# EAGLE schematic Main (EAGLE 7.4.0)
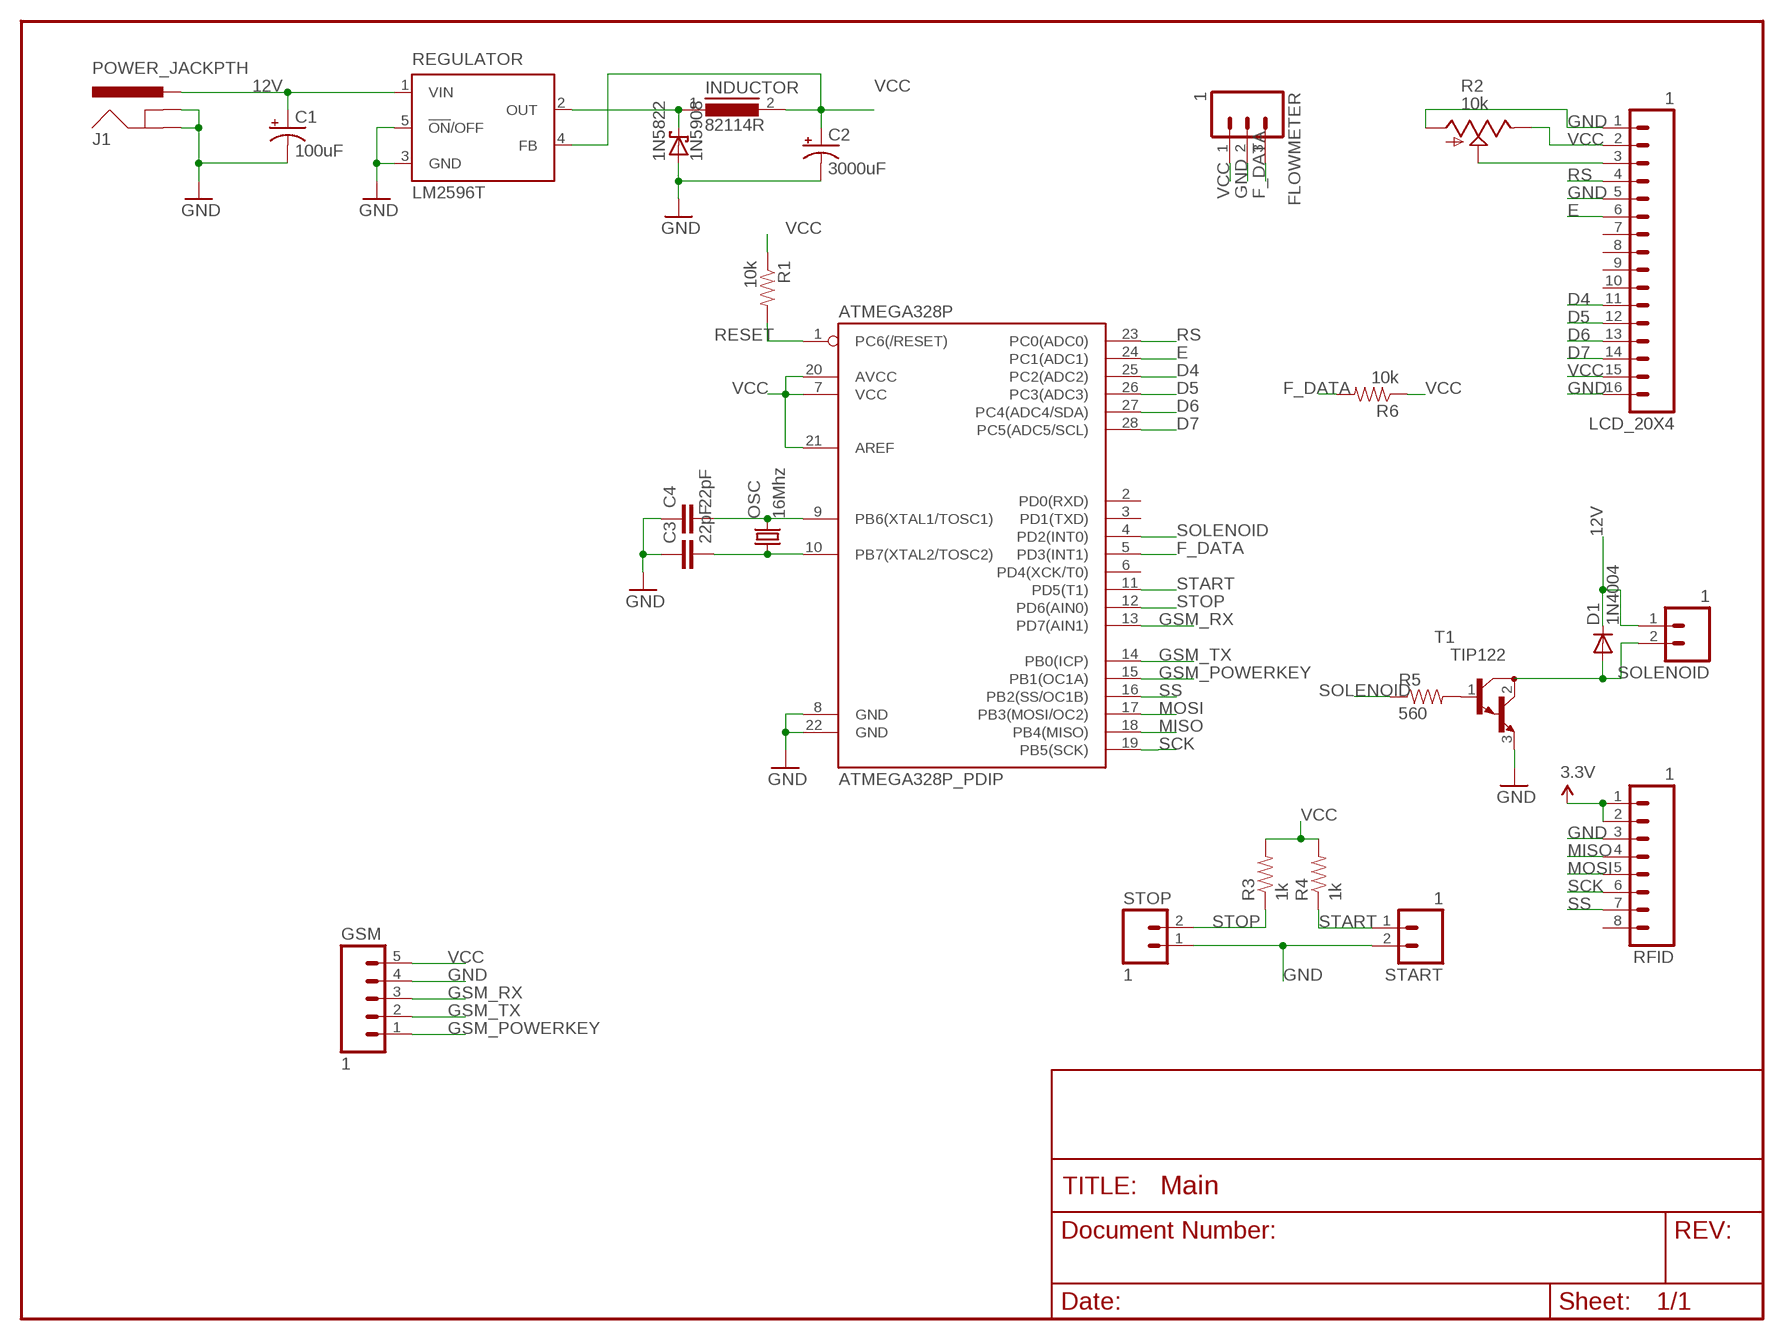
[diagram p0: schematic, sheet 1]

## Parts
1N5822  1N5908  [C4111-15]
ATMEGA328P  ATMEGA328P_PDIP  [DIL28-3]
C1  100uF  CAP_POLPTH2  [CPOL-RADIAL-10UF-25V]
C2  3000uF  CAP_POLPTH4  [CPOL-RADIAL-1000UF-25V]
C3  22pF  CAPPTH  [CAP-PTH-SMALL]
C4  22pF  CAPPTH  [CAP-PTH-SMALL]
D1  1N4004  [DO41-10]
FLOWMETER  1  M03PTH  [1X03]
GSM  1  M05PTH_LONGPADS  [1X05_LONGPADS]
INDUCTOR  82114R  [82114R]
J1  POWER_JACKPTH  [POWER_JACK_PTH]
LCD_20X4  1  M16PTH  [1X16]
OSC  16Mhz  CRYSTALHC49US  [HC49US]
R1  10k  RESISTORPTH-1/4W  [AXIAL-0.4]
R2  10k  TRIM_US-CA6V  [CA6V]
R3  1k  RESISTORPTH-1/4W  [AXIAL-0.4]
R4  1k  RESISTORPTH-1/4W  [AXIAL-0.4]
R5  560  RESISTORPTH-1/2W  [AXIAL-0.5]
R6  10k  RESISTORPTH-1/4W  [AXIAL-0.4]
REGULATOR  LM2596T  [T05D]
RFID  1  M08  [1X08_ROUND]
SOLENOID  1  M02PTH  [1X02]
START  1  M02PTH  [1X02]
STOP  1  M02PTH  [1X02]
T1  TIP122  [TO220]

## Nets
3.3V: RFID.1 RFID.2
12V: C1.1(+) D1.C J1.PWR REGULATOR.1(VIN) SOLENOID.1
D4: ATMEGA328P.25(PC2(ADC2)) LCD_20X4.11
D5: ATMEGA328P.26(PC3(ADC3)) LCD_20X4.12
D6: ATMEGA328P.27(PC4(ADC4/SDA)) LCD_20X4.13
D7: ATMEGA328P.28(PC5(ADC5/SCL)) LCD_20X4.14
E: ATMEGA328P.24(PC1(ADC1)) LCD_20X4.6
F_DATA: ATMEGA328P.5(PD3(INT1)) FLOWMETER.3 R6.P$2
GND: 1N5822.A ATMEGA328P.8(GND) ATMEGA328P.22(GND) C1.2(-) C2.2(-) C3.1 C4.1 FLOWMETER.2 GSM.4 J1.GND J1.GNDBREAK LCD_20X4.1 LCD_20X4.5 LCD_20X4.16 R2.A REGULATOR.3(GND) REGULATOR.5(!ON!/OFF) RFID.3 START.2 STOP.1 T1.3(E)
GSM_POWERKEY: ATMEGA328P.15(PB1(OC1A)) GSM.1
GSM_RX: ATMEGA328P.13(PD7(AIN1)) GSM.3
GSM_TX: ATMEGA328P.14(PB0(ICP)) GSM.2
MISO: ATMEGA328P.18(PB4(MISO)) RFID.4
MOSI: ATMEGA328P.17(PB3(MOSI/OC2)) RFID.5
N$2: R5.P$2 T1.1(B)
N$3: 1N5822.C INDUCTOR.1 REGULATOR.2(OUT)
N$4: ATMEGA328P.9(PB6(XTAL1/TOSC1)) C4.2 OSC.2
N$5: ATMEGA328P.10(PB7(XTAL2/TOSC2)) C3.2 OSC.1
N$6: D1.A SOLENOID.2 T1.2(C)
N$8: LCD_20X4.3 R2.S
RESET: ATMEGA328P.1(PC6(/RESET)) R1.P$2
RS: ATMEGA328P.23(PC0(ADC0)) LCD_20X4.4
SCK: ATMEGA328P.19(PB5(SCK)) RFID.6
SOLENOID: ATMEGA328P.4(PD2(INT0)) R5.P$1
SS: ATMEGA328P.16(PB2(SS/OC1B)) RFID.7
START: ATMEGA328P.11(PD5(T1)) R4.P$1 START.1
STOP: ATMEGA328P.12(PD6(AIN0)) R3.P$1 STOP.2
VCC: ATMEGA328P.7(VCC) ATMEGA328P.20(AVCC) ATMEGA328P.21(AREF) C2.1(+) FLOWMETER.1 GSM.5 INDUCTOR.2 LCD_20X4.2 LCD_20X4.15 R1.P$1 R2.E R3.P$2 R4.P$2 R6.P$1 REGULATOR.4(FB)
Unconnected: ATMEGA328P.2(PD0(RXD)) ATMEGA328P.3(PD1(TXD)) ATMEGA328P.6(PD4(XCK/T0)) LCD_20X4.7 LCD_20X4.8 LCD_20X4.9 LCD_20X4.10 RFID.8

## Library data of the parts
1N5822 = diode-1:1N5908: DIODE schottky
ATMEGA328P = SparkFun-DigitalIC:ATMEGA328P_PDIP: uC used in the Arduino 32kb flash, 1k EEPROM, 2k SRAM This is the through-hole version of this chip.
C1 C2 = SparkFun:CAP_POL: Capacitor Polarized These are standard SMD and PTH capacitors. Normally 10uF, 47uF, and 100uF in electrolytic and tantalum varieties. Always verify the external diameter of the through hole cap, it varies with capacity, voltage, and manufacturer. The EIA devices should be standard.
C3 C4 = SparkFun:CAP: Capacitor Standard 0603 ceramic capacitor, and 0.1" leaded capacitor.
D1 = adafruit:1N4004: DIODE General purpose 1N400x type rectifier (With bigger pads) http://www.ladyada.net/library/pcb/eaglelibrary.html
FLOWMETER = SparkFun-Connectors:M03: Header 3 Standard 3-pin 0.1" header. Use with straight break away headers (SKU : PRT-00116), right angle break away headers (PRT-00553), swiss pins (PRT-00743), machine pins (PRT-00117), and female headers (PRT-00115). Molex polarized connector foot print use with SKU : PRT-08232 with associated crimp pins and housings.
GSM = SparkFun-Connectors:M05: Header 5 Standard 5-pin 0.1" header. Use with straight break away headers (SKU : PRT-00116), right angle break away headers (PRT-00553), swiss pins (PRT-00743), machine pins (PRT-00117), and female headers (PRT-00115). Molex polarized connector foot print use with SKU : PRT-08230 with associated crimp pins and housings.
INDUCTOR = inductors:82114R: INDUCTOR
J1 = SparkFun:POWER_JACK: Power Jack This is the standard 5.5mm barrel jack for power. The PTH is the most common, proven, reliable, footprint. All others are experimental. The Slot footprint only works if the mill layer is transmitted to the PCB fab house so be warned. Spark Fun Electronics SKU : PRT-00119. Mating wall wart : TOL-00298 (and others)
LCD_20X4 = SparkFun-Connectors:M16: 1x16 .1" header
OSC = SparkFun-FreqCtrl:CRYSTAL: Various standard crystals. Proven footprints.
R1 R6 = SparkFun-Passives:RESISTOR: Resistor Basic schematic elements and footprints for 0603, 1206, and PTH resistors.
R2 = pot:TRIM_US-: POTENTIOMETER
R3-R5 = SparkFun:RESISTOR: Resistor Basic schematic elements and footprints for 0603, 1206, and PTH resistors.
REGULATOR = national-semiconductor:LM2596: SIMPLE SWITCHER® Power Converter 150 kHz 3A Step-Down Voltage Regulator Source: http://www.national.com/ds/LM/LM2596.pdf; MPN: LM2596T-ADJ/LF02; OC_FARNELL: 9494162; OC_NEWARK: 65K5910
RFID = SparkFun-Connectors:M08: Header 8 Standard 8-pin 0.1" header. Use with straight break away headers (SKU : PRT-00116), right angle break away headers (PRT-00553), swiss pins (PRT-00743), machine pins (PRT-00117), and female headers (PRT-00115).
SOLENOID START STOP = SparkFun-Connectors:M02: Standard 2-pin 0.1" header. Use with - straight break away headers ( PRT-00116) - right angle break away headers (PRT-00553) - swiss pins (PRT-00743) - machine pins (PRT-00117) - female headers (PRT-00115) Molex polarized connector foot print use with: PRT-08233 with associated crimp pins and housings. 2.54_SCREWTERM for use with PRT-10571. 3.5mm Screw Terminal footprints for PRT-08084 5mm Screw Terminal footprints for use with PRT-08432
T1 = transistor:TIP122: NPN BIPOLAR DARLINGTON TRANSISTOR